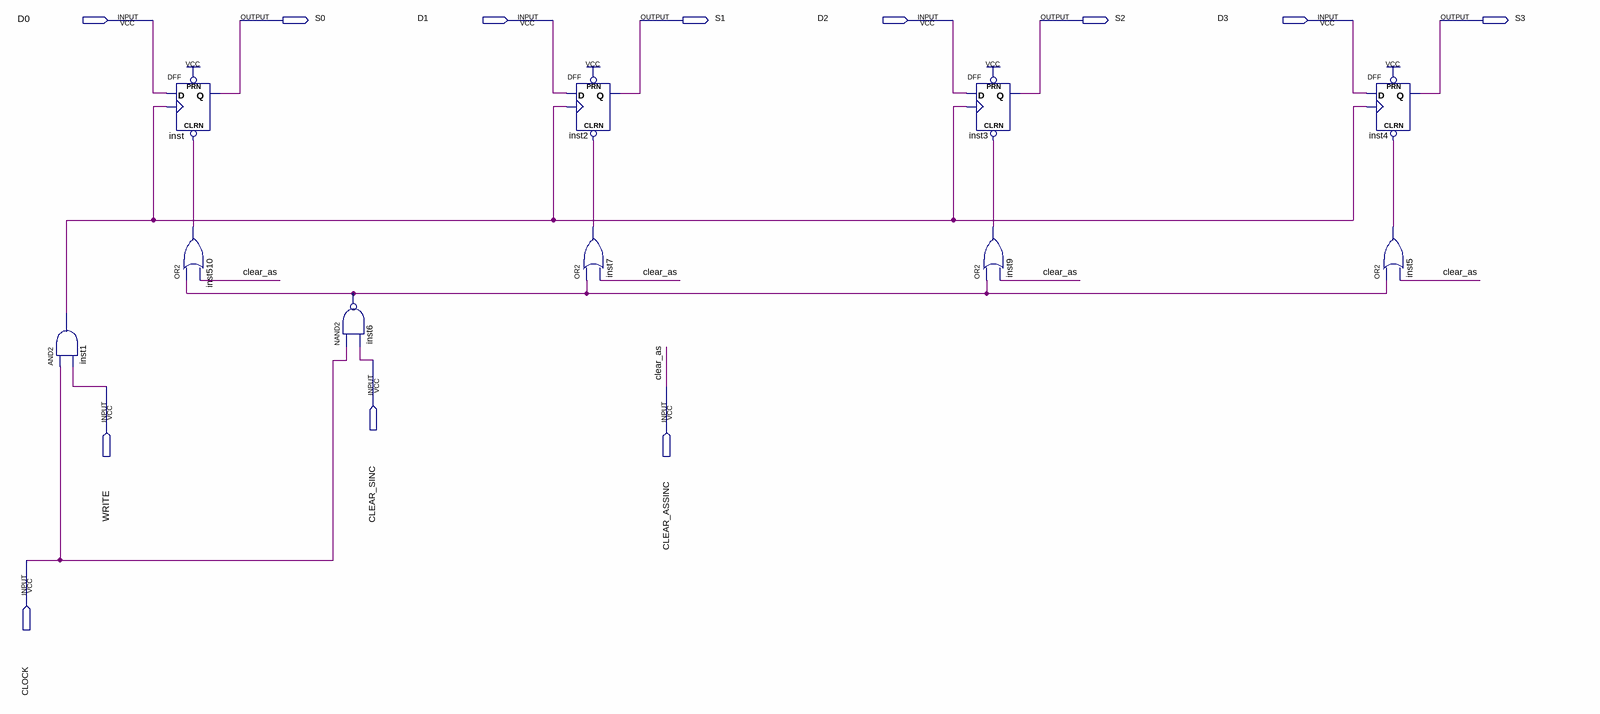
[diagram p0: schematic sheet]
// Quartus schematic Reg4Bits.bdf as structural Verilog: 10 symbols, 12 pins
module Reg4Bits (
  input  D0,
  input  D1,
  input  D2,
  input  D3,
  input  CLEAR_SINC,
  input  WRITE,
  input  CLEAR_ASSINC,
  input  CLOCK,
  output S0,
  output S1,
  output S2,
  output S3
);

  wire inst1_out, inst5_out, inst6_out, inst7_out, inst9_out, inst510_out;

  and inst1 (inst1_out, CLOCK, WRITE);
  DFF inst (.CLRN(inst510_out), .CLK(inst1_out), .D(D0), .PRN(1'b1), .Q(S0));
  or inst510 (inst510_out, inst6_out, CLEAR_ASSINC);
  nand inst6 (inst6_out, CLOCK, CLEAR_SINC);
  DFF inst2 (.CLRN(inst7_out), .CLK(inst1_out), .D(D1), .PRN(1'b1), .Q(S1));
  or inst7 (inst7_out, inst6_out, CLEAR_ASSINC);
  DFF inst3 (.CLRN(inst9_out), .CLK(inst1_out), .D(D2), .PRN(1'b1), .Q(S2));
  or inst9 (inst9_out, inst6_out, CLEAR_ASSINC);
  DFF inst4 (.CLRN(inst5_out), .CLK(inst1_out), .D(D3), .PRN(1'b1), .Q(S3));
  or inst5 (inst5_out, inst6_out, CLEAR_ASSINC);

  // Other names for the same wires on the sheet: clear_as = CLEAR_ASSINC
endmodule
